# EAGLE schematic FairyControler (EAGLE 9.5.2)
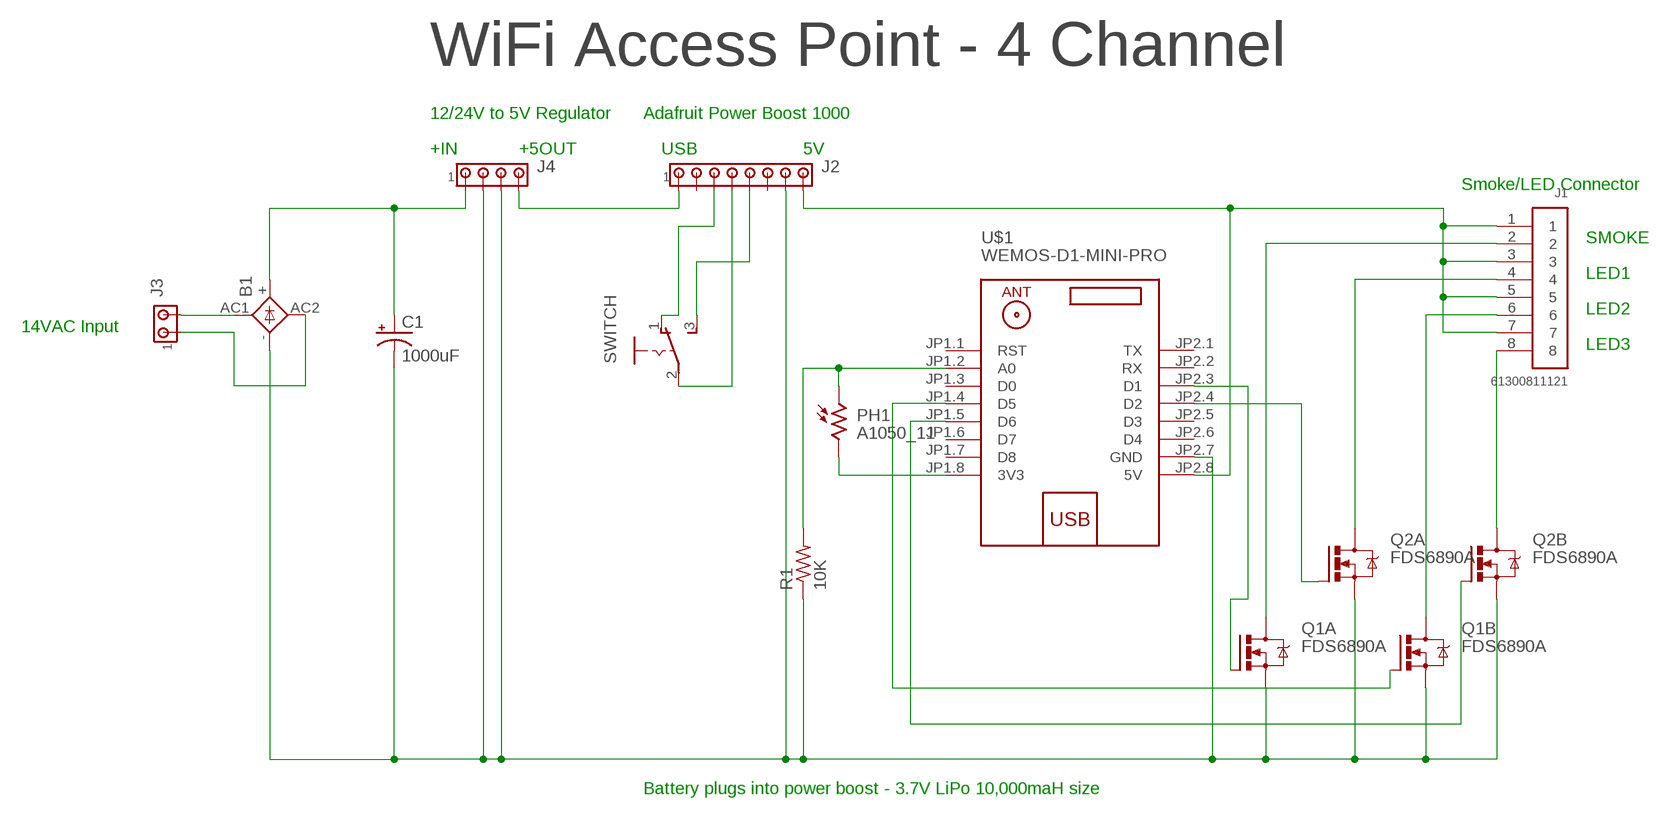
[diagram p0: schematic, sheet 1]

## Parts
B1  2KBP  [2KBP]
C1  1000uF  CPOL-USE3.5-10  [E3,5-10]
J1  61300811121  [61300811121]
J2  MTA08-100  [10X08MTA]
J3  MTA02-100  [10X02MTA]
J4  MTA04-100  [10X04MTA]
PH1  A1050_11  [T0-46-A10XX]
Q1  FDS6890A  [M08A]
Q2  FDS6890A  [M08A]
R1  10K  R-US_0204/7  [0204/7]
SWITCH  255SB  [255SB]
U$1  WEMOS-D1-MINI-PRO  [WEMOS-D1-MINI-PRO]

## Nets
N$1: B1.AC1 J3.2
N$2: B1.AC2 J3.1
N$3: B1.+ C1.+ J4.1
N$4: B1.- C1.- J2.7 J4.2 J4.3 Q1.1(A:S) Q1.3(B:S) Q2.1(A:S) Q2.3(B:S) R1.1 U$1.JP2.7(GND)
N$5: J2.1 J4.4
N$6: J2.4 SWITCH.2(P)
N$7: J2.5 SWITCH.3(S)
N$8: J2.3 SWITCH.1(O)
N$9: J1.1 J1.3 J1.5 J1.7 J2.8 U$1.JP2.8(5V)
N$10: PH1.1 R1.2 U$1.JP1.2(A0)
N$11: J1.2 Q1.7(A:D) Q1.8(A:D)
N$12: J1.4 Q2.7(A:D) Q2.8(A:D)
N$13: J1.6 Q1.5(B:D) Q1.6(B:D)
N$14: J1.8 Q2.5(B:D) Q2.6(B:D)
N$15: Q1.2(A:G) U$1.JP2.3(D1)
N$16: Q2.2(A:G) U$1.JP2.4(D2)
N$17: Q1.4(B:G) U$1.JP1.4(D5)
N$18: Q2.4(B:G) U$1.JP1.5(D6)
N$19: PH1.2 U$1.JP1.8(3V3)
Unconnected: J2.2 J2.6 U$1.JP1.1(RST) U$1.JP1.3(D0) U$1.JP1.6(D7) U$1.JP1.7(D8) U$1.JP2.1(TX) U$1.JP2.2(RX) U$1.JP2.5(D3) U$1.JP2.6(D4)

## Notes on the sheet
- WiFi Access Point - 4 Channel
- 12/24V to 5V Regulator | Adafruit Power Boost 1000
- +IN | +5OUT | USB | 5V
- Smoke/LED Connector
- SMOKE
- LED1
- LED2
- 14VAC Input
- LED3
- Battery plugs into power boost - 3.7V LiPo 10,000maH size

## Library data of the parts
B1 = rectifier:2KBP: RECTIFIER grid 3 x 3,81 mm
C1 = adafruit:CPOL-US: POLARIZED CAPACITOR, American symbol
J1 = Headers:61300811121: CONN HEADER VERT 8POS 2.54MM Manufacturer's datasheet <https://katalog.we-online.de/em/datasheet/6130xx11121.pdf>; CREATED_BY: PCBLayout.com; DIGI_KEY_PART_NUMBER: 732-5321-ND; MANUFACTURER: Wurth Electronics Inc.; MPN: 61300811121
J2 = con-amp:MTA08-100: AMP connector
J3 = con-amp:MTA02-100: AMP connector
J4 = con-amp:MTA04-100: AMP connector
PH1 = photo-elements:A10: Sensor Robust Light Sensing Applications Outdoor Light Sensing Application Source: http://optoelectronics.perkinelmer.com/content/Datasheets/DTS_PhotocellsA1050.pdf
Q1 Q2 = transistor-power:FDS6890A: Dual N-Channel 2.5V Specified PowerTrenchTM MOSFET Source: FDS6890A.pdf
R1 = rcl:R-US_: RESISTOR, American symbol; SPICEPREFIX: R
SWITCH = switch:255SB: SLIDING SWITCH Distributor Buerklin, 11G810
U$1 = diy-modules:WEMOS-D1-MINI-PRO: WEMOS D1 mini Pro: Mini Wi-Fi Board based on ESP-8266EX chip More details can be found here: https://www.wemos.cc/product/d1-mini-pro.html Click here to find device on ebay.com <http://www.ebay.com/sch/wemos+d1+mini+pro>

## Module WEMOS
Ports: 

### Library data of the parts